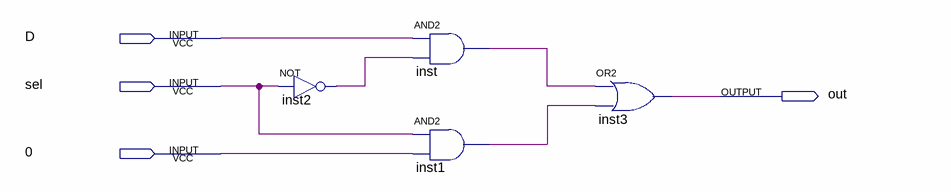
[diagram p0: schematic sheet]
// Quartus schematic 2to1_mux.bdf as structural Verilog: 4 symbols, 4 pins
module \2to1_mux  (
  input  D,
  input  sel,
  input  \0 ,
  output out
);

  wire inst1_out, inst2_out, inst_out;

  not inst2 (inst2_out, sel);
  and inst (inst_out, D, inst2_out);
  and inst1 (inst1_out, sel, \0 );
  or inst3 (out, inst_out, inst1_out);
endmodule
